# Altium schematic sheet main.SchDoc
size A
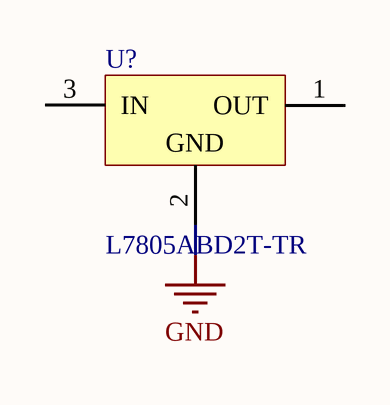
[diagram p0: main.SchDoc]

## Parts
U?  L7805ABD2T-TR  [TO-263-3]

## Nets
GND: U?.2(GND)

Not connected (* = marked no-connect by the designer): U? 1(OUT) 3(IN)

## Library data of the parts
U? = CMP-006-0001-2: Linear Voltage Regulators 5.0V 1.0A Positive; Accuracy: 2%; V_drop: 2V; Voltage: 5V; V_in_max: 35V; Max Output Current: 1.5A; Quiescent Current: 6mA; Output Type: Fixed; Min Input Voltage: 7V; Power Supply Rejection Ratio (PSRR): 68dB; Number of Outputs: 1; System: Connector; ComponentLink1URL: https://www.digikey.no/product-detail/en/stmicroelectronics/L7805ABD2T-TR/497-1170-1-ND/586170; Source: Power.SchLib; Width: 4.6mm; Radiation Hardening: No; Mount: Surface Mount,Through Hole; Lead Free: Lead Free; Contact Plating: Tin,Matte; Min Operating Temperature: -40°C; ComponentLink2URL: http://www.st.com/content/ccc/resource/technical/document/datasheet/41/4f/b3/b0/12/d4/47/88/CD00000444.pdf/files/CD00000444.pdf/jcr:content/translations/en.CD00000444.pdf; Package Quantity: 1; Output Voltage: 5V; Output Current: 1.5A; Min Output Voltage: 5V; Max Operating Temperature: 125°C; Height: 9.35mm; Nominal Output Voltage: 5V; ComponentLink2Description: datasheet; REACH SVHC: No SVHC; Polarity: Positive; Length: 10.4mm; ComponentLink1Description: digikey; Dropout Voltage: 2V; Output Voltage Accuracy: 2%; Packaging: Tape and Reel; Design Item ID: L7805; Max Input Voltage: 35V; Pin Count: 3; Case/Package: TO-263; Weight: 7.1E-05oz; Number of Regulators: 1; Number of Pins: 3